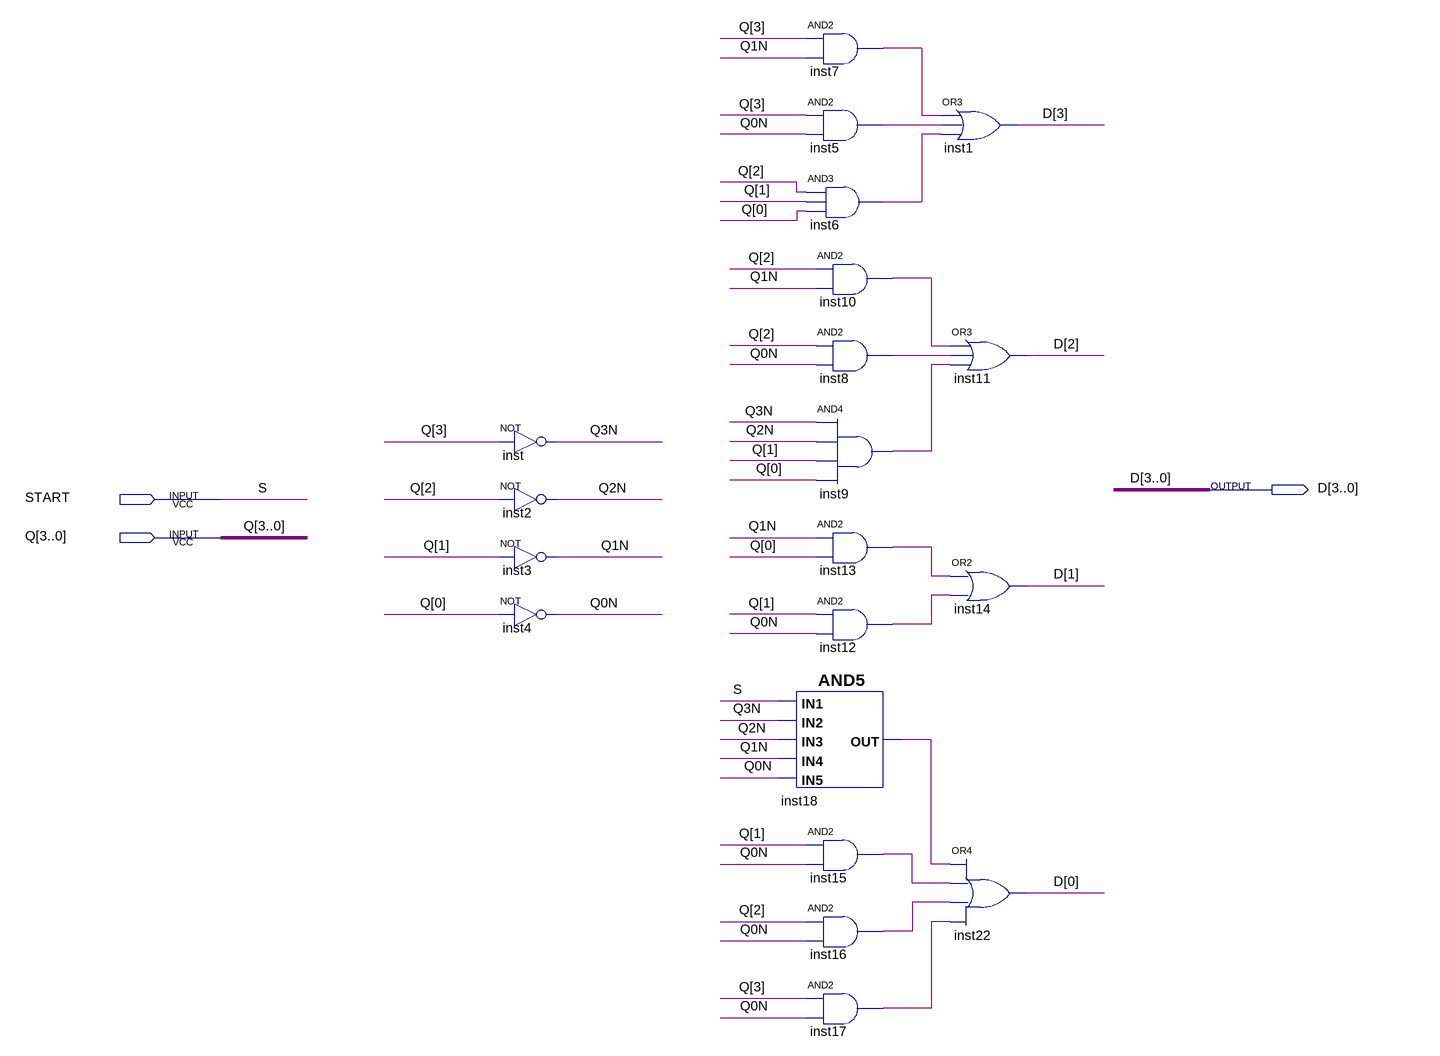
[diagram p0: schematic sheet]
// Quartus schematic NEXT_STATE.bdf as structural Verilog: 20 symbols, 3 pins
module NEXT_STATE (
  input  START,
  input  [3:0] Q,
  output [3:0] D
);

  wire inst5_out, inst6_out, inst7_out, inst8_out, inst9_out, inst10_out, inst12_out, inst13_out, inst15_out,
       inst16_out, inst17_out, inst18_out, Q0N, Q1N, Q2N, Q3N;

  not inst (Q3N, Q[3]);
  not inst2 (Q2N, Q[2]);
  not inst3 (Q1N, Q[1]);
  not inst4 (Q0N, Q[0]);
  and inst18 (inst18_out, START, Q3N, Q2N, Q1N, Q0N);
  and inst7 (inst7_out, Q[3], Q1N);
  and inst5 (inst5_out, Q[3], Q0N);
  and inst6 (inst6_out, Q[2], Q[1], Q[0]);
  and inst10 (inst10_out, Q[2], Q1N);
  and inst8 (inst8_out, Q[2], Q0N);
  and inst9 (inst9_out, Q3N, Q2N, Q[1], Q[0]);
  and inst13 (inst13_out, Q1N, Q[0]);
  and inst12 (inst12_out, Q[1], Q0N);
  and inst15 (inst15_out, Q[1], Q0N);
  and inst16 (inst16_out, Q[2], Q0N);
  and inst17 (inst17_out, Q[3], Q0N);
  or inst1 (D[3], inst7_out, inst5_out, inst6_out);
  or inst11 (D[2], inst10_out, inst8_out, inst9_out);
  or inst14 (D[1], inst13_out, inst12_out);
  or inst22 (D[0], inst18_out, inst15_out, inst16_out, inst17_out);

  // Other names for the same wires on the sheet: S = START
endmodule
